# EAGLE design base (EAGLE 9.6.2)
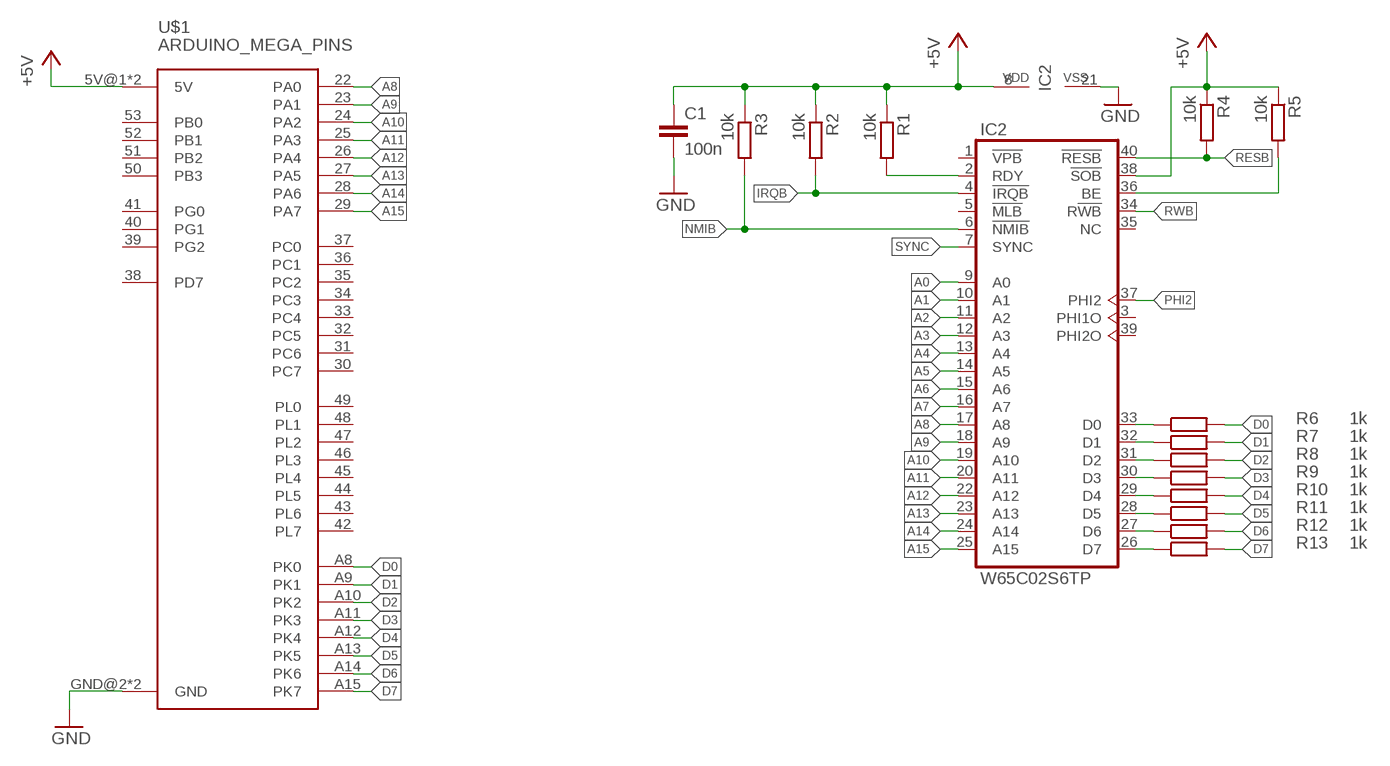
[diagram p0: schematic, sheet 1]

## Parts
C1  100n  C-EUC0805  [C0805]
IC2  W65C02S6TP  [DIL40]
R1  10k  R-EU_R0805  [R0805]
R2  10k  R-EU_R0805  [R0805]
R3  10k  R-EU_R0805  [R0805]
R4  10k  R-EU_R0805  [R0805]
R5  10k  R-EU_R0805  [R0805]
R6  1k  R-EU_R0805  [R0805]
R7  1k  R-EU_R0805  [R0805]
R8  1k  R-EU_R0805  [R0805]
R9  1k  R-EU_R0805  [R0805]
R10  1k  R-EU_R0805  [R0805]
R11  1k  R-EU_R0805  [R0805]
R12  1k  R-EU_R0805  [R0805]
R13  1k  R-EU_R0805  [R0805]
U$1  ARDUINO_MEGA_PINS  [ARDUINO_MEGA_PINS]

## Nets
+5V: C1.1 IC2.8(P:VDD) IC2.38(1:!SOB) R1.1 R2.1 R3.1 R4.1 R5.1 U$1.5V@1(5V) U$1.5V@2(5V)
A0: IC2.9(1:A0)
A1: IC2.10(1:A1)
A2: IC2.11(1:A2)
A3: IC2.12(1:A3)
A4: IC2.13(1:A4)
A5: IC2.14(1:A5)
A6: IC2.15(1:A6)
A7: IC2.16(1:A7)
A8: IC2.17(1:A8) U$1.22(PA0)
A9: IC2.18(1:A9) U$1.23(PA1)
A10: IC2.19(1:A10) U$1.24(PA2)
A11: IC2.20(1:A11) U$1.25(PA3)
A12: IC2.22(1:A12) U$1.26(PA4)
A13: IC2.23(1:A13) U$1.27(PA5)
A14: IC2.24(1:A14) U$1.28(PA6)
A15: IC2.25(1:A15) U$1.29(PA7)
BE: IC2.36(1:BE) R5.2
D0: R6.2 U$1.A8(PK0)
D1: R7.2 U$1.A9(PK1)
D2: R8.2 U$1.A10(PK2)
D3: R9.2 U$1.A11(PK3)
D4: R10.2 U$1.A12(PK4)
D5: R11.2 U$1.A13(PK5)
D6: R12.2 U$1.A14(PK6)
D7: R13.2 U$1.A15(PK7)
GND: C1.2 IC2.21(P:VSS) U$1.GND@2(GND) U$1.GND@3(GND)
IRQB: IC2.4(1:!IRQB) R2.2
N$1: IC2.33(1:D0) R6.1
N$2: IC2.32(1:D1) R7.1
N$3: IC2.31(1:D2) R8.1
N$4: IC2.30(1:D3) R9.1
N$5: IC2.29(1:D4) R10.1
N$6: IC2.28(1:D5) R11.1
N$7: IC2.27(1:D6) R12.1
N$8: IC2.26(1:D7) R13.1
NMIB: IC2.6(1:!NMIB) R3.2
PHI2: IC2.37(1:PHI2)
RDY: IC2.2(1:RDY) R1.2
RESB: IC2.40(1:!RESB) R4.2
RWB: IC2.34(1:R!WB)
SYNC: IC2.7(1:SYNC)
Unconnected: IC2.1(1:!VPB) IC2.3(1:PHI1O) IC2.5(1:!MLB) IC2.35(1:NC) IC2.39(1:PHI2O) U$1.30(PC7) U$1.31(PC6) U$1.32(PC5) U$1.33(PC4) U$1.34(PC3) U$1.35(PC2) U$1.36(PC1) U$1.37(PC0) U$1.38(PD7) U$1.39(PG2) U$1.40(PG1) U$1.41(PG0) U$1.42(PL7) U$1.43(PL6) U$1.44(PL5) U$1.45(PL4) U$1.46(PL3) U$1.47(PL2) U$1.48(PL1) U$1.49(PL0) U$1.50(PB3) U$1.51(PB2) U$1.52(PB1) U$1.53(PB0)

## Library data of the parts
C1 = rcl:C-EU: CAPACITOR, European symbol; SPICEPREFIX: C
IC2 = 6502_lib:W65C02S: W65C02 by WDC
R1-R13 = rcl:R-EU_: RESISTOR, European symbol; SPICEPREFIX: R
U$1 = 6502_lib:ARDUINO_MEGA_PINS

## Board
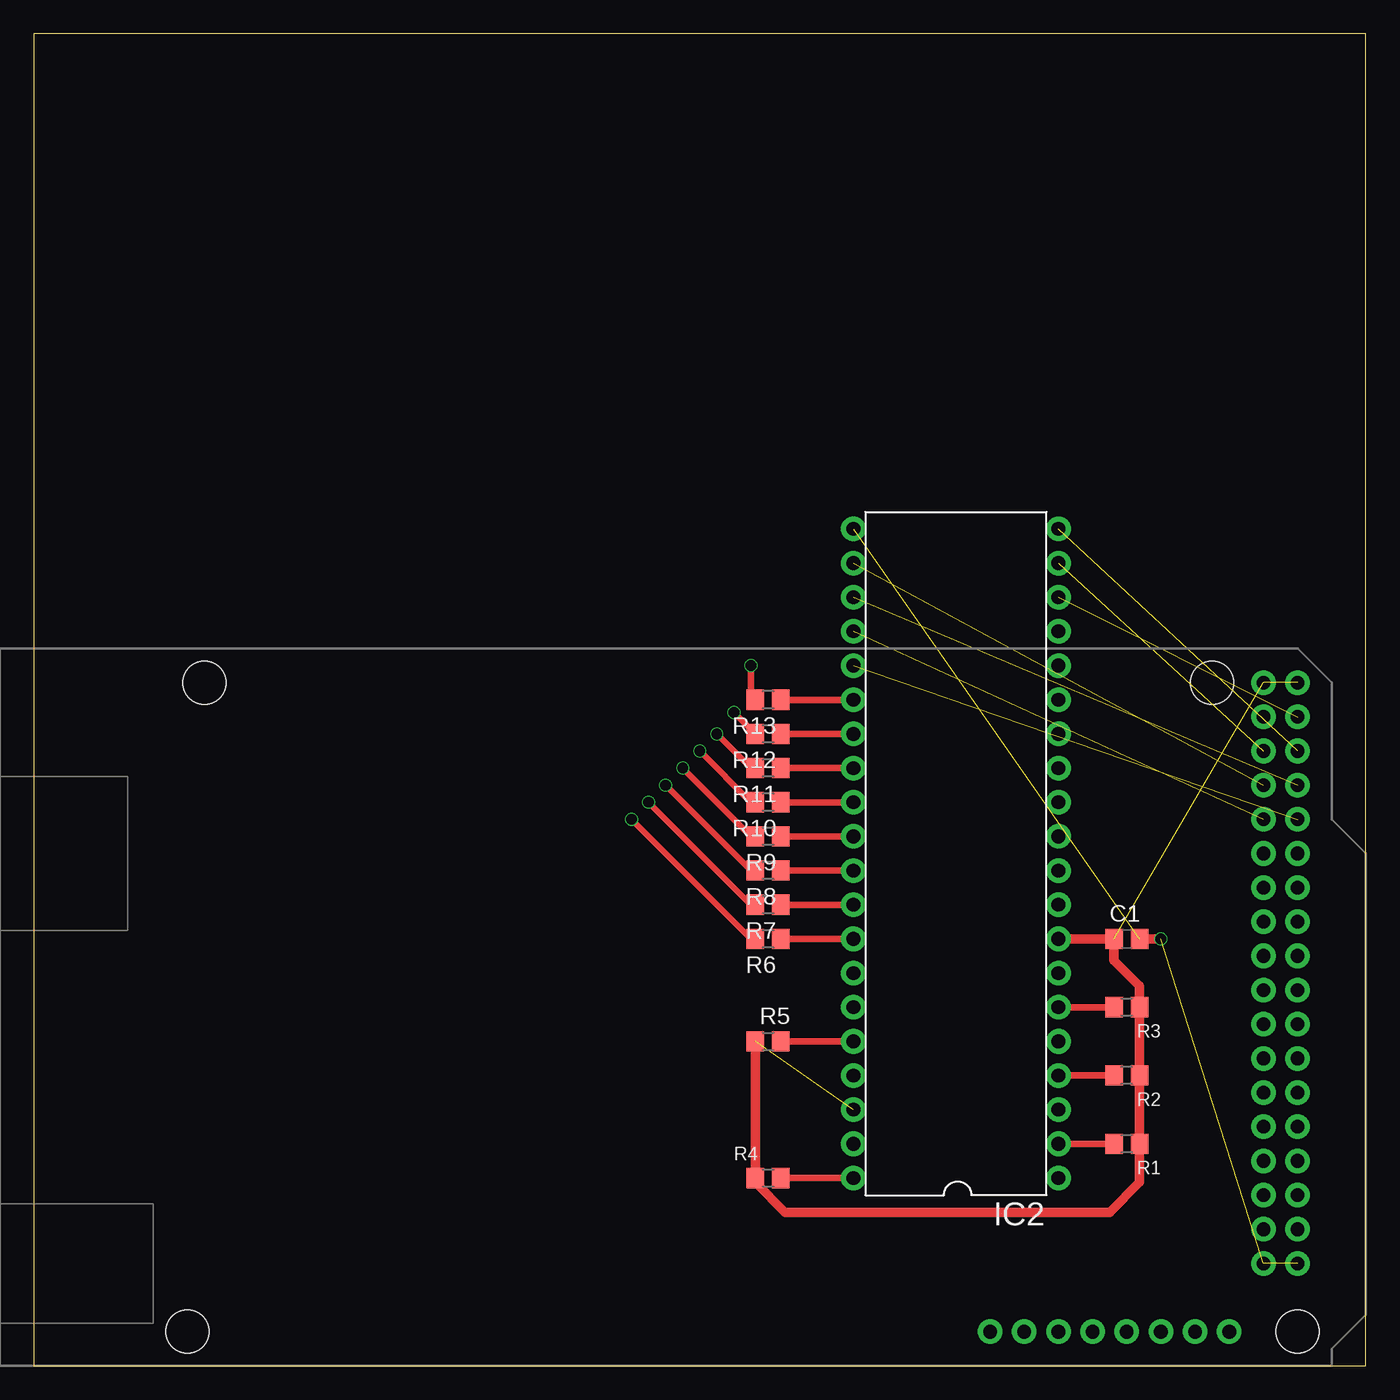
[diagram p1: board, top side]
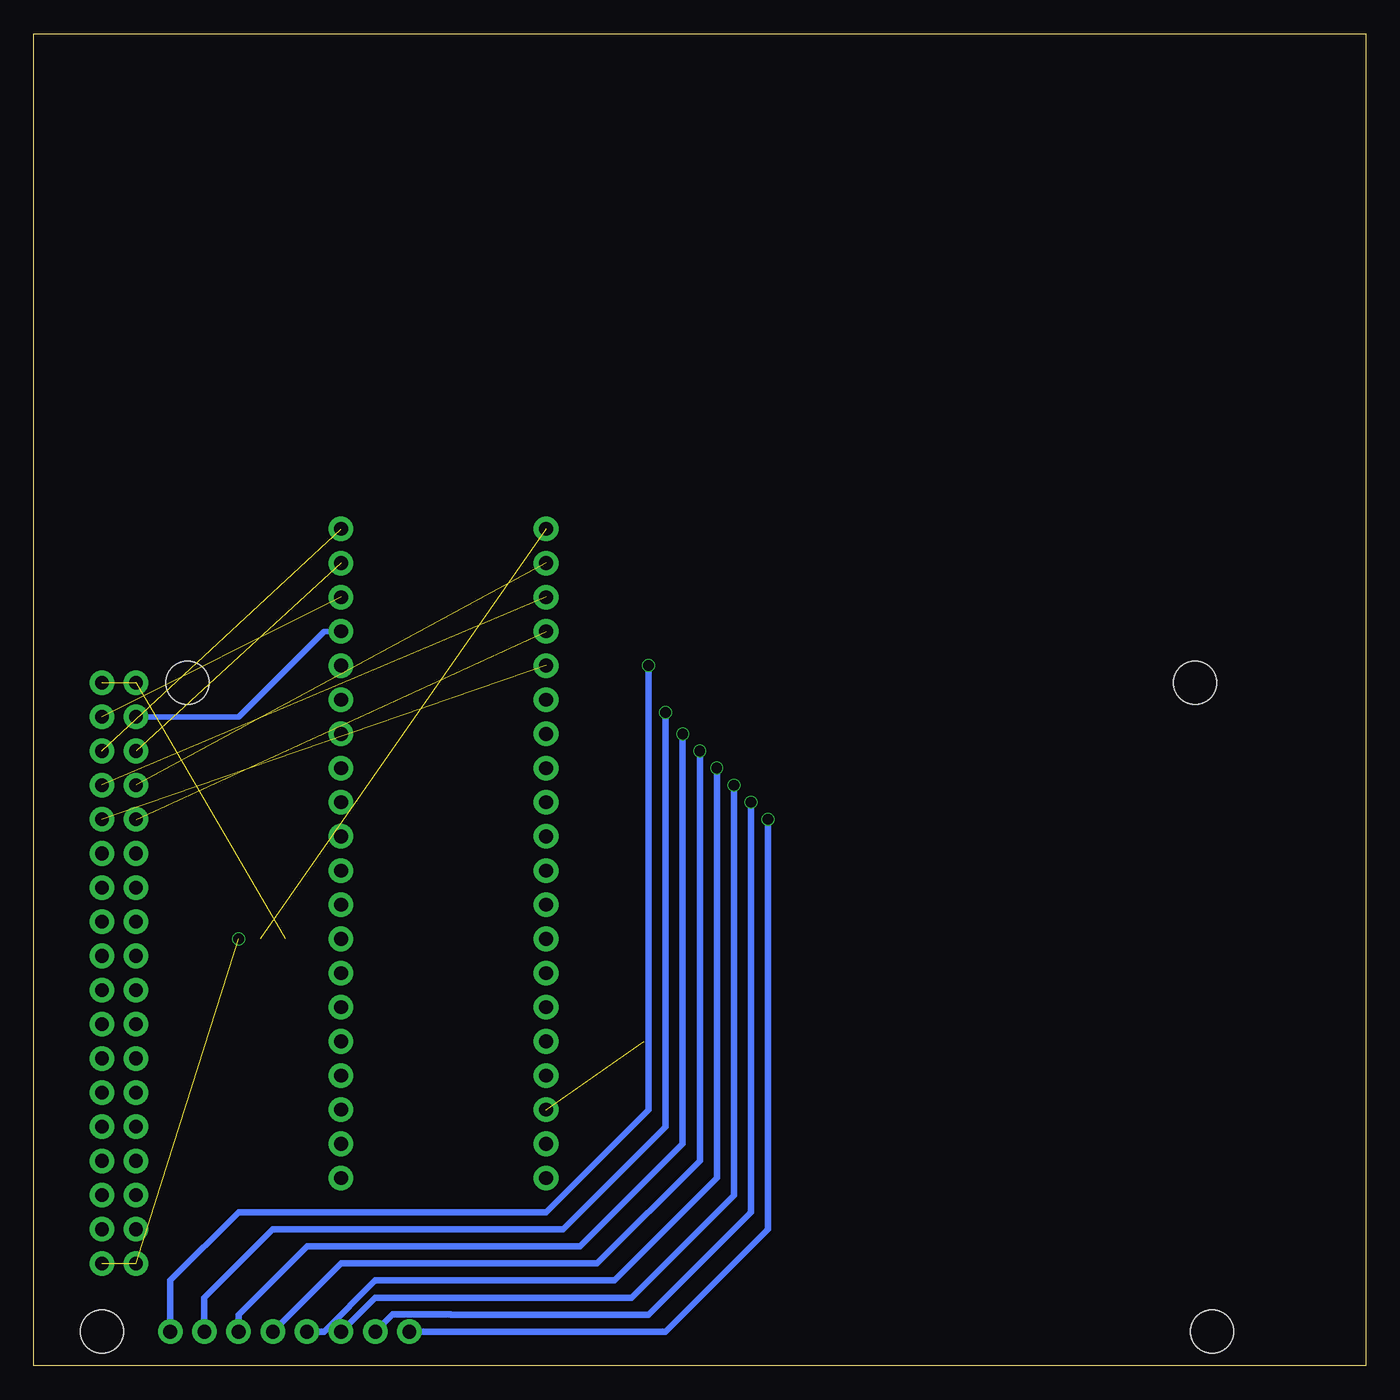
[diagram p2: board, bottom side, seen from below]

Size 99.06 x 99.06 mm. Coordinates in mm from the lower left corner, seen from the top.
Outline: 0,0 99.06,0 99.06,99.06 0,99.06 0,0
Copper layers (1*16): Top 0.035mm / dielectric 1.6mm / Bottom 0.035mm
Design rules "jlcpcb-2layers": minimum track width 5mil, minimum drill 0.3mm, track to track 5mil, track to pad 5mil, pad to pad 5mil, via to via 5mil, smd to smd 5mil, copper to edge 0.2mm, drill to drill 6mil, minimum pad ring 10mil, minimum via ring 3mil, stop-mask expansion 4mil, vias tented up to drill 0mil, thermal gap 10mil

### Footprints (pad centres in the part's own frame; a part is rotated, then mirrored left to right if it is on the bottom)
C0805 = smd 1.3 x 1.5: 1 -0.95,0; 2 0.95,0
DIL40 = drill 1.016 pad 1.778: 1 -24.13,-7.62; 2 -21.59,-7.62; 3 -19.05,-7.62; 4 -16.51,-7.62; 5 -13.97,-7.62; 6 -11.43,-7.62; 7 -8.89,-7.62; 8 -6.35,-7.62; 9 -3.81,-7.62; 10 -1.27,-7.62; 11 1.27,-7.62; 12 3.81,-7.62; 13 6.35,-7.62; 14 8.89,-7.62; 15 11.43,-7.62; 16 13.97,-7.62; 17 16.51,-7.62; 18 19.05,-7.62; 19 21.59,-7.62; 20 24.13,-7.62; 21 24.13,7.62; 22 21.59,7.62; 23 19.05,7.62; 24 16.51,7.62; 25 13.97,7.62; 26 11.43,7.62; 27 8.89,7.62; 28 6.35,7.62; 29 3.81,7.62; 30 1.27,7.62; 31 -1.27,7.62; 32 -3.81,7.62; 33 -6.35,7.62; 34 -8.89,7.62; 35 -11.43,7.62; 36 -13.97,7.62; 37 -16.51,7.62; 38 -19.05,7.62; 39 -21.59,7.62; 40 -24.13,7.62
R0805 = smd 1.3 x 1.5: 1 -0.95,0; 2 0.95,0
ARDUINO_MEGA_PINS = drill 1.016 pad 1.778: 5V@1 44.45,24.13; 5V@2 46.99,24.13; 22 44.45,21.59; 23 46.99,21.59; 24 44.45,19.05; 25 46.99,19.05; 26 44.45,16.51; 27 46.99,16.51; 28 44.45,13.97; 29 46.99,13.97; 30 44.45,11.43; 31 46.99,11.43; 32 44.45,8.89; 33 46.99,8.89; 34 44.45,6.35; 35 46.99,6.35; 36 44.45,3.81; 37 46.99,3.81; 38 44.45,1.27; 39 46.99,1.27; 40 44.45,-1.27; 41 46.99,-1.27; 42 44.45,-3.81; 43 46.99,-3.81; 44 44.45,-6.35; 45 46.99,-6.35; 46 44.45,-8.89; 47 46.99,-8.89; 48 44.45,-11.43; 49 46.99,-11.43; 50 44.45,-13.97; 51 46.99,-13.97; 52 44.45,-16.51; 53 46.99,-16.51; A8 24.13,-24.13; A9 26.67,-24.13; A10 29.21,-24.13; A11 31.75,-24.13; A12 34.29,-24.13; A13 36.83,-24.13; A14 39.37,-24.13; A15 41.91,-24.13; GND@2 44.45,-19.05; GND@3 46.99,-19.05 | hole 3.2: -34.29,24.13; -35.56,-24.13; 40.64,24.13; 46.99,-24.13

### Placement (x,y rotation side)
C1  81.28,31.75 0 top
IC2  68.58,38.1 90 top
R1  81.28,16.51 180 top
R2  81.28,21.59 180 top
R3  81.28,26.67 180 top
R4  54.61,13.97 0 top
R5  54.61,24.13 0 top
R6  54.61,31.75 180 top
R7  54.61,34.29 180 top
R8  54.61,36.83 180 top
R9  54.61,39.37 180 top
R10  54.61,41.91 180 top
R11  54.61,44.45 180 top
R12  54.61,46.99 180 top
R13  54.61,49.53 180 top
U$1  46.99,26.67 0 top

### Tracks (layer width: path | path; a pad name or v marks a point on that pad's centre or on a via)
+5V  (3 unrouted)
  Top 0.7: IC2.8 C1.1 80.33,30.16 82.23,28.26 R3.1 R2.1 R1.1 82.23,13.65 80.01,11.43 55.88,11.43 53.66,13.65 R4.1 R5.1
A8
  Bottom 0.4: IC2.17 77.47,54.61 83.82,48.26 U$1.22
A9  (1 unrouted)
A10  (1 unrouted)
A11  (1 unrouted)
A12  (1 unrouted)
A13  (1 unrouted)
A14  (1 unrouted)
A15  (1 unrouted)
BE
  Top 0.5: R5.2 IC2.36
D0  (via drill 0.8)
  Top 0.5: R6.2 53.34,31.75 v44.45,40.64
  Bottom 0.5: U$1.A8 52.07,2.54 44.45,10.16 v44.45,40.64
D1  (via drill 0.8)
  Top 0.5: R7.2 53.34,34.29 v45.72,41.91
  Bottom 0.5: U$1.A9 72.37,3.83 68.05,3.83 68.02,3.81 53.34,3.81 45.72,11.43 v45.72,41.91
D2  (via drill 0.8)
  Top 0.5: R8.2 53.34,36.83 v46.99,43.18
  Bottom 0.5: U$1.A10 73.66,5.08 54.61,5.08 46.99,12.7 v46.99,43.18
D3  (via drill 0.8)
  Top 0.5: R9.2 53.34,39.37 v48.26,44.45
  Bottom 0.5: U$1.A11 77.47,2.54 73.66,6.35 55.88,6.35 48.26,13.97 v48.26,44.45
D4  (via drill 0.8)
  Top 0.5: R10.2 53.34,41.91 v49.53,45.72
  Bottom 0.5: U$1.A12 76.2,7.62 57.15,7.62 49.53,15.24 v49.53,45.72
D5  (via drill 0.8)
  Top 0.5: R11.2 53.34,44.45 v50.8,46.99
  Bottom 0.5: U$1.A13 83.82,3.81 78.74,8.89 58.42,8.89 50.8,16.51 v50.8,46.99
D6  (via drill 0.8)
  Top 0.5: R12.2 v52.07,48.58
  Bottom 0.5: U$1.A14 86.36,5.08 81.28,10.16 59.69,10.16 52.07,17.78 v52.07,48.58
D7  (via drill 0.8)
  Top 0.5: R13.2 53.34,49.85 v53.34,52.07
  Bottom 0.5: v53.34,52.07 53.34,19.05 60.96,11.43 83.82,11.43 88.9,6.35 U$1.A15
GND  (via drill 0.8)  (3 unrouted)
  Top 0.7: C1.2 v83.82,31.75
IRQB
  Top 0.5: R2.2 IC2.4
N$1
  Top 0.5: R6.1 IC2.33
N$2
  Top 0.5: R7.1 IC2.32
N$3
  Top 0.5: R8.1 IC2.31
N$4
  Top 0.5: R9.1 IC2.30
N$5
  Top 0.5: R10.1 IC2.29
N$6
  Top 0.5: R11.1 IC2.28
N$7
  Top 0.5: R12.1 IC2.27
N$8
  Top 0.5: R13.1 IC2.26
NMIB
  Top 0.5: R3.2 IC2.6
RDY
  Top 0.5: R1.2 IC2.2
RESB
  Top 0.5: R4.2 IC2.40